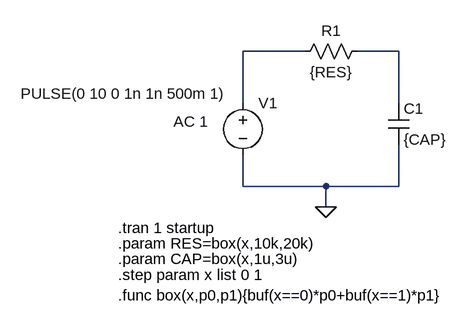
[diagram p0: schematic Draft1.asc]
Draft1.asc, the LTspice schematic file:
Version 4.1
SHEET 1 880 680
WIRE 208 -16 112 -16
WIRE 352 -16 288 -16
WIRE 112 64 112 -16
WIRE 352 64 352 -16
WIRE 112 192 112 144
WIRE 240 192 112 192
WIRE 352 192 352 128
WIRE 352 192 240 192
WIRE 240 224 240 192
FLAG 240 224 0
SYMBOL voltage 112 48 R0
WINDOW 3 -342 1 Left 2
WINDOW 123 -107 44 Left 2
WINDOW 39 0 0 Left 0
SYMATTR InstName V1
SYMATTR Value PULSE(0 10 0 1n 1n 500m 1)
SYMATTR Value2 AC 1
SYMBOL cap 336 64 R0
SYMATTR InstName C1
SYMATTR Value {CAP}
SYMBOL res 304 -32 R90
WINDOW 0 0 56 VBottom 2
WINDOW 3 32 56 VTop 2
SYMATTR InstName R1
SYMATTR Value {RES}
TEXT -80 256 Left 2 !.tran 1 startup
TEXT -80 280 Left 2 !.param RES=box(x,10k,20k)
TEXT -80 304 Left 2 !.param CAP=box(x,1u,3u)
TEXT -80 328 Left 2 !.step param x list 0 1
TEXT -80 360 Left 2 !.func box(x,p0,p1){buf(x==0)*p0+buf(x==1)*p1}

The netlist it stands for:
* Draft1.asc
V1 N001 0 PULSE(0 10 0 1n 1n 500m 1) AC 1
C1 N002 0 {CAP}
R1 N002 N001 {RES}
.tran 1 startup
.param RES=box(x,10k,20k)
.param CAP=box(x,1u,3u)
.step param x list 0 1
.func box(x,p0,p1){buf(x==0)*p0+buf(x==1)*p1}
.backanno
.end